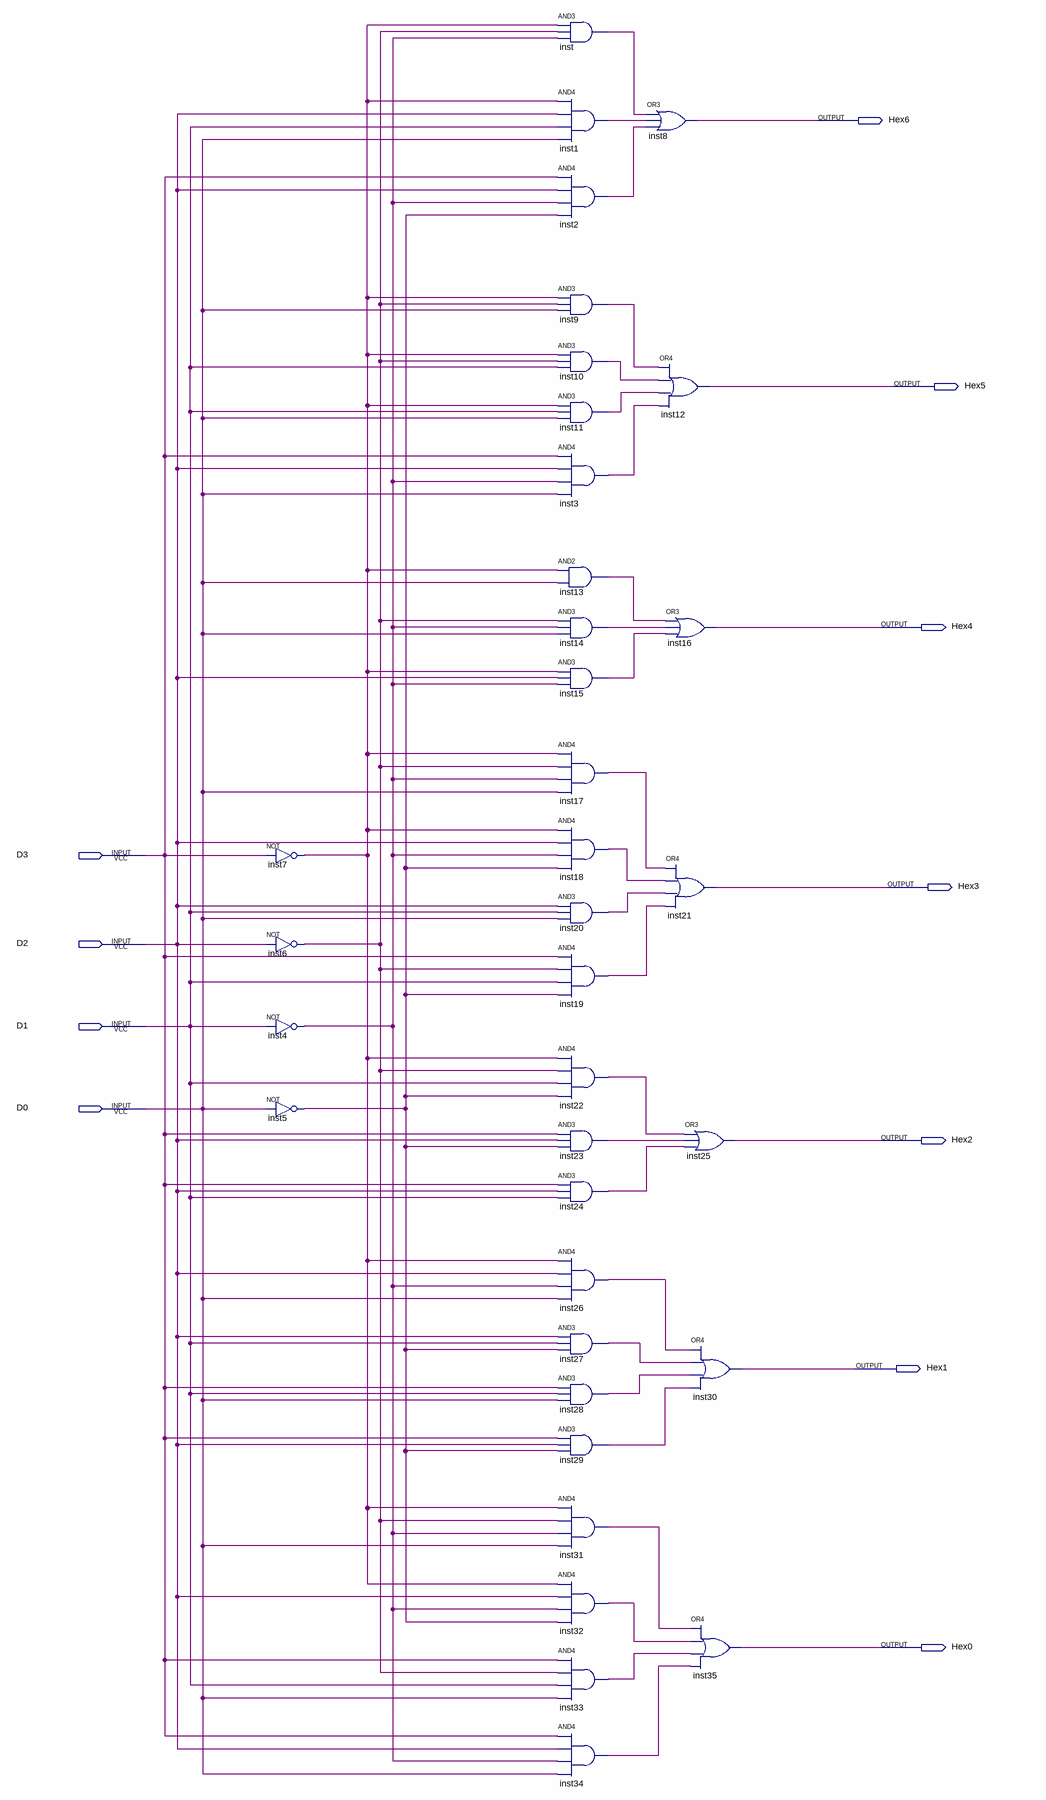
[diagram p0: schematic sheet]
// Quartus schematic 4b_7segment.bdf as structural Verilog: 36 symbols, 11 pins
module \4b_7segment  (
  input  D3,
  input  D2,
  input  D1,
  input  D0,
  output Hex6,
  output Hex5,
  output Hex4,
  output Hex3,
  output Hex2,
  output Hex1,
  output Hex0
);

  wire inst1_out, inst2_out, inst3_out, inst4_out, inst5_out, inst6_out, inst7_out, inst9_out, inst10_out,
       inst11_out, inst13_out, inst14_out, inst15_out, inst17_out, inst18_out, inst19_out, inst20_out,
       inst22_out, inst23_out, inst24_out, inst26_out, inst27_out, inst28_out, inst29_out, inst31_out,
       inst32_out, inst33_out, inst34_out, inst_out;

  not inst7 (inst7_out, D3);
  not inst6 (inst6_out, D2);
  not inst4 (inst4_out, D1);
  not inst5 (inst5_out, D0);
  and inst (inst_out, inst7_out, inst6_out, inst4_out);
  and inst1 (inst1_out, inst7_out, D2, D1, D0);
  and inst2 (inst2_out, D3, D2, inst4_out, inst5_out);
  and inst9 (inst9_out, inst7_out, inst6_out, D0);
  and inst10 (inst10_out, inst7_out, inst6_out, D1);
  and inst11 (inst11_out, inst7_out, D1, D0);
  and inst3 (inst3_out, D3, D2, inst4_out, D0);
  and inst13 (inst13_out, inst7_out, D0);
  and inst14 (inst14_out, inst6_out, inst4_out, D0);
  and inst15 (inst15_out, inst7_out, D2, inst4_out);
  and inst17 (inst17_out, inst7_out, inst6_out, inst4_out, D0);
  and inst18 (inst18_out, inst7_out, D2, inst4_out, inst5_out);
  and inst20 (inst20_out, D2, D1, D0);
  and inst19 (inst19_out, D3, inst6_out, D1, inst5_out);
  and inst22 (inst22_out, inst7_out, inst6_out, D1, inst5_out);
  and inst23 (inst23_out, D3, D2, inst5_out);
  and inst24 (inst24_out, D3, D2, D1);
  and inst26 (inst26_out, inst7_out, D2, inst4_out, D0);
  and inst27 (inst27_out, D2, D1, inst5_out);
  and inst28 (inst28_out, D3, D1, D0);
  and inst29 (inst29_out, D3, D2, inst5_out);
  and inst31 (inst31_out, inst7_out, inst6_out, inst4_out, D0);
  and inst32 (inst32_out, inst7_out, D2, inst4_out, inst5_out);
  and inst33 (inst33_out, D3, inst6_out, D1, D0);
  and inst34 (inst34_out, D3, D2, inst4_out, D0);
  or inst8 (Hex6, inst_out, inst1_out, inst2_out);
  or inst12 (Hex5, inst9_out, inst10_out, inst11_out, inst3_out);
  or inst16 (Hex4, inst13_out, inst14_out, inst15_out);
  or inst21 (Hex3, inst17_out, inst18_out, inst20_out, inst19_out);
  or inst25 (Hex2, inst22_out, inst23_out, inst24_out);
  or inst30 (Hex1, inst26_out, inst27_out, inst28_out, inst29_out);
  or inst35 (Hex0, inst31_out, inst32_out, inst33_out, inst34_out);
endmodule
